# EAGLE design eduino_wifi_rev3 (EAGLE 7.6.0)
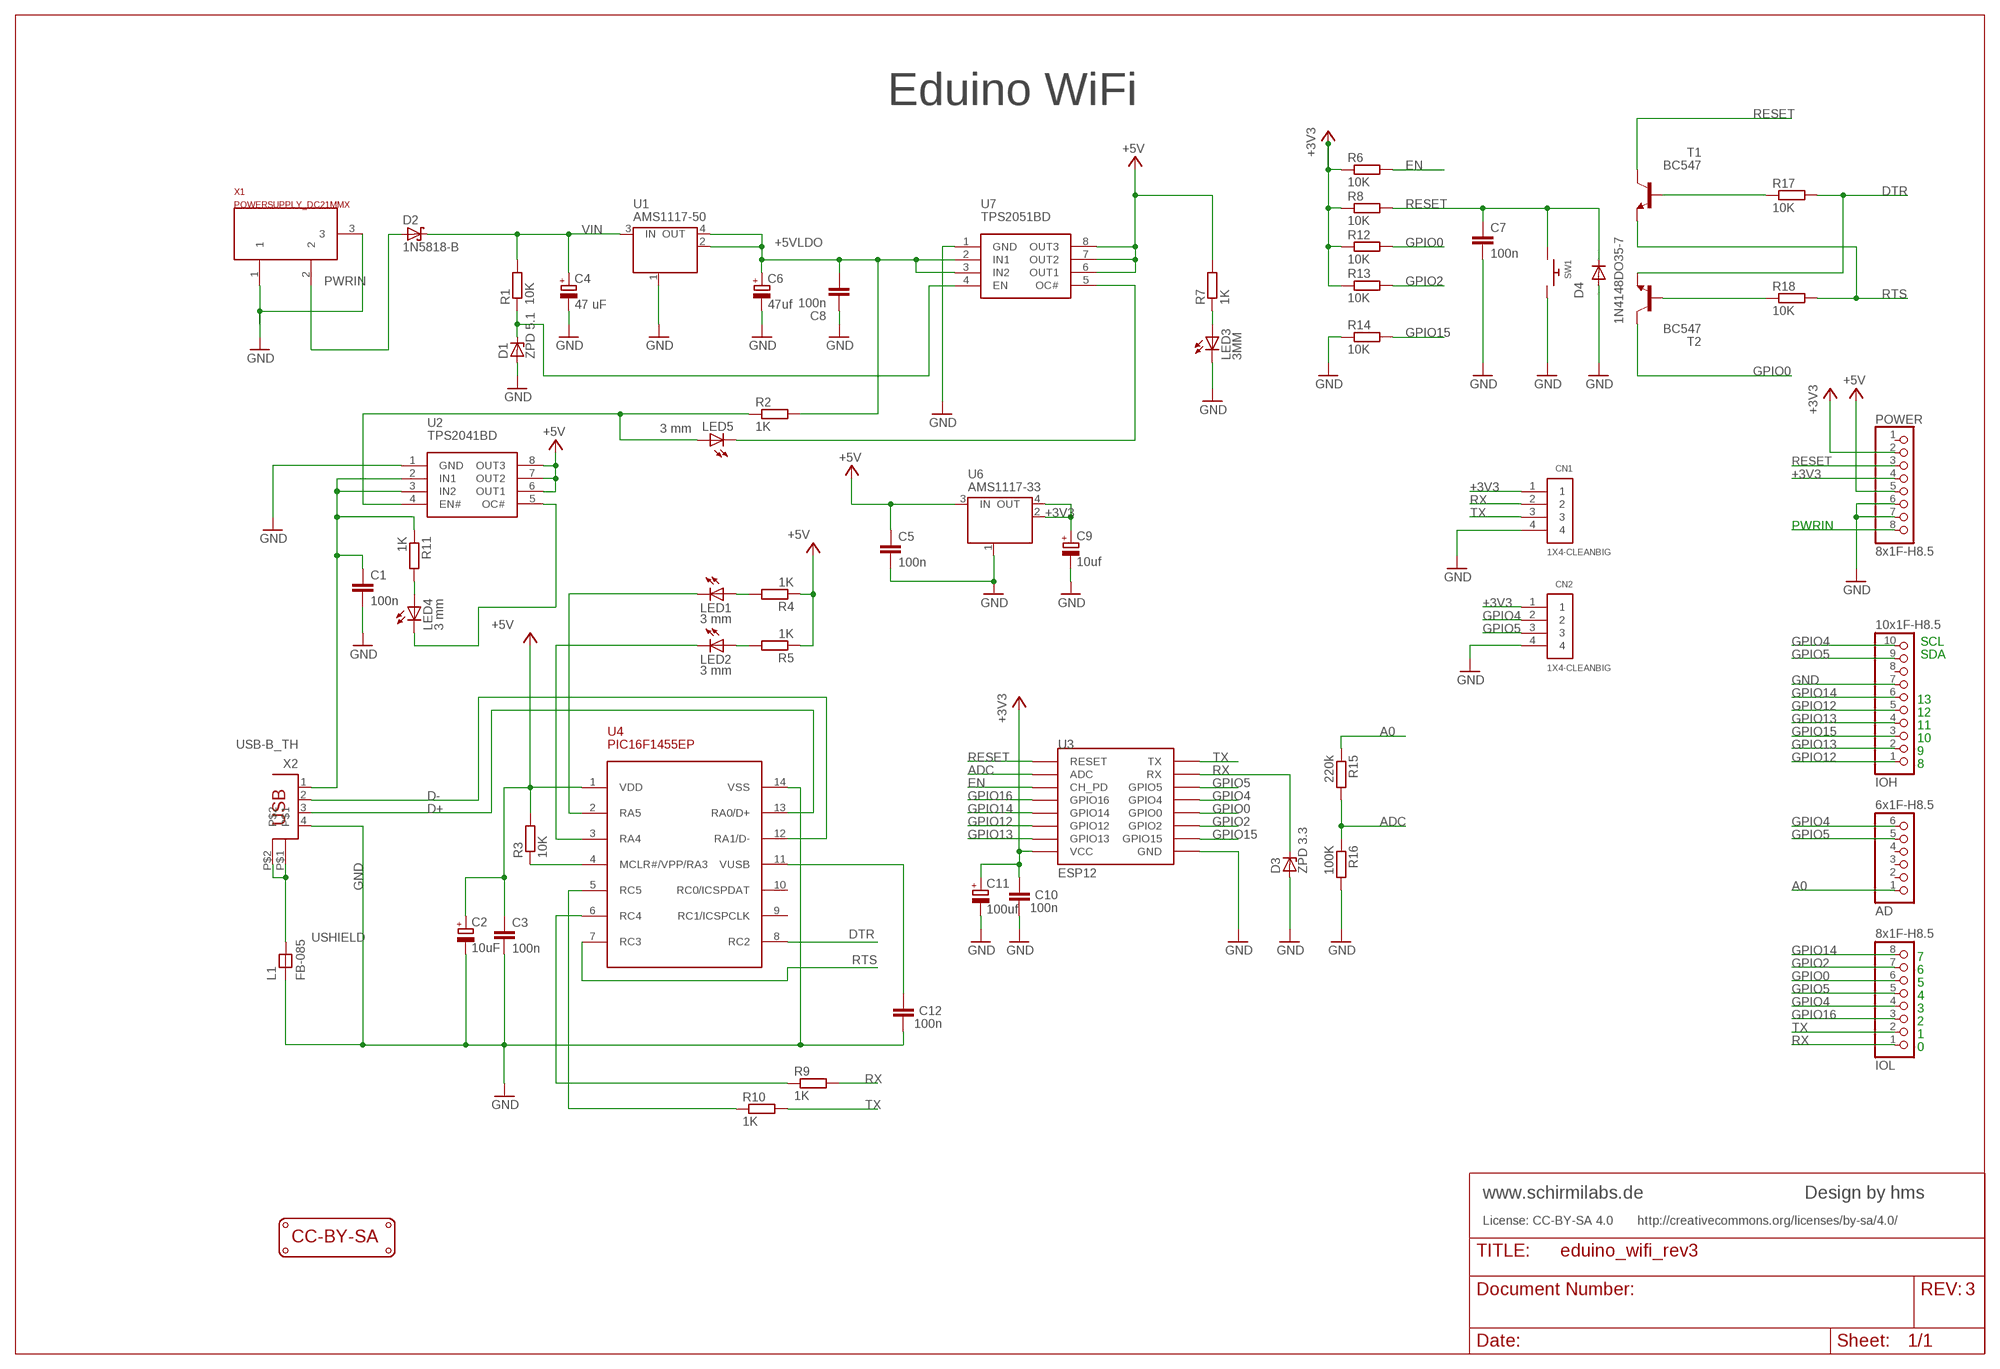
[diagram p0: schematic, sheet 1]

## Parts
AD  6x1F-H8.5  PINHD-1X6  [1X06]
C1  100n  C-EU025-024X044  [C025-024X044]
C2  10uF  CPOL-EUE2-5  [E2-5]
C3  100n  C-EU025-024X044  [C025-024X044]
C4  47 uF  CPOL-EUE2-5  [E2-5]
C5  100n  C-EU025-024X044  [C025-024X044]
C6  47uf  CPOL-EUE2-5  [E2-5]
C7  100n  C-EU025-024X044  [C025-024X044]
C8  100n  CAPACITOR_NPOL-PTH_0.1"  [C0.1PTH]
C9  10uf  CPOL-EUE2-5  [E2-5]
C10  100n  CAPACITOR_NPOL-PTH_0.1"  [C0.1PTH]
C11  100uf  CPOL-EUE2-5  [E2-5]
C12  100n  CAPACITOR_NPOL-PTH_0.1"  [C0.1PTH]
CN1  1X4-CLEANBIG  [1X04-CLEANBIG]
CN2  1X4-CLEANBIG  [1X04-CLEANBIG]
D1  ZPD 5.1  ZENER-DIODEDO35Z10  [DO35Z10]
D2  1N5818-B  [DO41-7.6]
D3  ZPD 3.3  ZPD  [DO35Z10]
D4  1N4148DO35-7  [DO35-7]
IOH  10x1F-H8.5  PINHD-1X10_ARD  [1X10]
IOL  8x1F-H8.5  PINHD-1X8  [1X08]
L1  FB-085  [FB-085]
LED1  3 mm  LED-3MM  [LED-3MM]
LED2  3 mm  LED-3MM  [LED-3MM]
LED3  3MM  LED-3MM  [LED-3MM]
LED4  3 mm  LED-3MM  [LED-3MM]
LED5  3 mm  LED-3MM  [LED-3MM]
LOGO1  LOGO_CC-BY-SA  [LOGO_CC-BY-SA]
POWER  8x1F-H8.5  PINHD-1X8  [1X08]
R1  10K  RESISTOR-PTH-0.4  [RTH025W]
R2  1K  RESISTOR-PTH-0.4  [RTH025W]
R3  10K  R-EU_0207/10  [0207/10]
R4  1K  RESISTOR-PTH-0.4  [RTH025W]
R5  1K  RESISTOR-PTH-0.4  [RTH025W]
R6  10K  RESISTOR-PTH-0.4  [RTH025W]
R7  1K  RESISTOR-PTH-0.4  [RTH025W]
R8  10K  RESISTOR-PTH-0.4  [RTH025W]
R9  1K  R-EU_0207/10  [0207/10]
R10  1K  R-EU_0207/10  [0207/10]
R11  1K  RESISTOR-PTH-0.4  [RTH025W]
R12  10K  RESISTOR-PTH-0.4  [RTH025W]
R13  10K  RESISTOR-PTH-0.4  [RTH025W]
R14  10K  RESISTOR-PTH-0.4  [RTH025W]
R15  220k  RESISTOR-PTH-0.4  [RTH025W]
R16  100K  RESISTOR-PTH-0.4  [RTH025W]
R17  10K  RESISTOR-PTH-0.4  [RTH025W]
R18  10K  RESISTOR-PTH-0.4  [RTH025W]
SW1  SWITCH_PUSHBUTTONEVQ-PE  [TACT_PANA-EVQ]
T1  BC547  [TO92]
T2  BC547  [TO92]
U1  AMS1117-50  MC33269ST-3.3T3  [SOT223]
U2  TPS2041BD  [SOIC-8]
U3  ESP12  ESP12SMD  [ESP12-SMD]
U4  PIC16F1455EP  [DIL14]
U6  AMS1117-33  MC33269ST-3.3T3  [SOT223]
U7  TPS2051BD  [SOIC-8]
X1  POWERSUPPLY_DC21MMX  [POWERSUPPLY_DC-21MM]
X2  USB-B_TH  PN61729  [PN61729]

## Nets
+3V3: C9.+ C10.2 C11.+ CN1.1 CN2.1 POWER.2 POWER.4 R6.1 R8.1 R12.1 R13.1 U3.VCC U6.2(OUT) U6.4(OUT)
+5V [usbvcc]: C2.+ C3.1 C5.1 POWER.5 R3.2 R4.1 R5.1 R7.2 U2.6(OUT1) U2.7(OUT2) U2.8(OUT3) U4.1(VDD) U6.3(IN) U7.6(OUT1) U7.7(OUT2) U7.8(OUT3)
+5VLDO [usbvcc]: C6.+ C8.2 R2.2 U1.2(OUT) U1.4(OUT) U7.2(IN1) U7.3(IN2)
A0: AD.1 R15.1
ADC: R15.2 R16.1 U3.ADC
D+: U4.13(RA0/D+) X2.3
D-: U4.12(RA1/D-) X2.2
DTR: R17.2 T2.1(E) U4.8(RC2)
EN: R6.2 U3.CH_PD
GND [gnd]: C1.2 C2.- C3.2 C4.- C5.2 C6.- C7.2 C8.1 C9.- C10.1 C11.- C12.1 CN1.4 CN2.4 D1.A D3.A D4.A IOH.7 L1.1 LED3.K(C) POWER.6 POWER.7 R14.1 R16.2 SW1.P$2 U1.1(GND/ADJ) U2.1(GND) U3.GND U4.14(VSS) U6.1(GND/ADJ) U7.1(GND) X1.1 X1.3 X2.4
GPIO0: IOL.6 R12.2 T2.3(C) U3.GPIO0
GPIO2: IOL.7 R13.2 U3.GPIO2
GPIO4: AD.6 CN2.2 IOH.10 IOL.4 U3.GPIO4(GPIO5)
GPIO5: AD.5 CN2.3 IOH.9 IOL.5 U3.GPIO5(GPIO4)
GPIO12: IOH.1 IOH.5 U3.GPIO12
GPIO13: IOH.2 IOH.4 U3.GPIO13
GPIO14: IOH.6 IOL.8 U3.GPIO14
GPIO15: IOH.3 R14.2 U3.GPIO15
GPIO16: IOL.3 U3.GPIO16
M8RXD: R9.1 U4.6(RC4)
M8TXD: R10.1 U4.5(RC5)
N$1: LED3.A R7.1
N$2: LED4.K(C) U2.5(OC#)
N$4: R3.1 U4.4(MCLR#/VPP/RA3)
N$5: LED1.K(C) U4.2(RA5)
N$6: LED2.K(C) U4.3(RA4)
N$7: LED1.A R4.2
N$8: LED2.A R5.2
N$9: C1.1 R11.1 U2.2(IN1) U2.3(IN2) X2.1
N$10: D1.C R1.1 U7.4(EN)
N$11 [usbvcc]: LED5.A R2.1 U2.4(EN#)
N$12: R17.1 T1.2(B)
N$13: LED4.A R11.2
N$15: C12.2 U4.11(VUSB)
N$17: LED5.K(C) U7.5(OC#)
N$21: R18.1 T2.2(B)
PWRIN [power]: D2.A POWER.8 X1.2
RESET: C7.1 D4.C POWER.3 R8.2 SW1.P$1 T1.3(C) U3.RESET
RTS: R18.2 T1.1(E) U4.7(RC3)
RX: CN1.2 D3.C IOL.1 R9.2 U3.RXD0(RX)
TX: CN1.3 IOL.2 R10.2 U3.TXD0(TX)
USHIELD [gnd]: L1.2 X2.P$1 X2.P$2
VIN [power]: C4.+ D2.C R1.2 U1.3(IN)
Unconnected: AD.2 AD.3 AD.4 IOH.8 POWER.1 U4.9(RC1/ICSPCLK) U4.10(RC0/ICSPDAT)

## Notes on the sheet
- Eduino WiFi
- PWRIN
- SCL
- SDA
- 13
- 12
- 11
- 10
- 9
- 8
- 7
- 6
- 5
- 4
- 3
- 2
- 1
- 0
- www.schirmilabs.de | Design by hms
- License: CC-BY-SA 4.0 | http://creativecommons.org/licenses/by-sa/4.0/
- 3

## Library data of the parts
AD = SmartPrj:PINHD-1X6: PIN HEADER
C1 C3 C5 C7 = resistor:C-EU: CAPACITOR, European symbol
C2 C4 C6 C9 C11 = resistor:CPOL-EU: POLARIZED CAPACITOR, European symbol
C8 C10 C12 = dp_devices:CAPACITOR_NPOL: Non-Polarized capacitor in various packages
CN1 CN2 = adafruit:1X4: 4-pin connector
D1 = diode:ZENER-DIODE: Z-Diode
D2 = diode:1N581*: 1.0A SCHOTTKY BARRIER RECTIFIER Source: http://www.diodes.com/datasheets/ds23001.pdf
D3 = diode:ZPD: Z DIODE 500 mW
D4 = diode:1N4148: DIODE high speed (Philips)
IOH = SmartPrj:PINHD-1X10_ARD: PIN HEADER
IOL POWER = SmartPrj:PINHD-1X8: PIN HEADER
L1 = inductors-jwmiller:FB: FERRITE BEAD
LED1-LED5 = dp_devices:LED: Light Emitting Diode
LOGO1 = dp_devices(1):LOGO_CC-BY-SA
R1 R2 R4-R8 R11-R18 = dp_devices:RESISTOR
R3 R9 R10 = resistor:R-EU_: RESISTOR, European symbol
SW1 = adafruit:SWITCH_PUSHBUTTON: Buttons SOFTTOUCHSMD_SJ - Soft touch temporary push button (Super Junk Akihabara) Compatible with SKPMANE010 [Mouser: 688-SKPMAN] C&K_KSS = Digikey: KSS221GLFS
T1 T2 = transistor-neu-to92:BC547: NPN TRANSISTOR
U1 U6 = linear:MC33269ST*: Adjustable Output Low Dropout Voltage Regulator 800 mA Source: http://www.onsemi.com/pub/Collateral/MC33269-D.PDF
U2 = schirmilabs:TPS2041BD
U3 = esp8266modules:ESP12: ESP8266 Wifi module 12
U4 = pic16f1455:PIC16F1455EP
U7 = schirmilabs:TPS2051BD
X1 = SmartPrj:POWERSUPPLY_DC21MM
X2 = SmartPrj:PN61729: BERG USB connector

## Net classes
0 default: width 0.254 mm, clearance 0.254 mm
1 power: width 0.61 mm, drill 0.61 mm, clearance 0.205 mm to class 0, clearance 0.254 mm
2 gnd: width 0.305 mm, drill 0.559 mm, clearance 0.205 mm to class 0, clearance 0.205 mm to class 1, clearance 0.254 mm
3 usbvcc: width 0.508 mm, drill 0.61 mm, clearance 0.205 mm to class 0, clearance 0.205 mm to class 1, clearance 0.205 mm to class 2, clearance 0.254 mm
4 aref: width 0.406 mm, drill 0.61 mm, clearance 0.205 mm to class 0, clearance 0.205 mm to class 1, clearance 0.205 mm to class 2, clearance 0.205 mm to class 3, clearance 0.254 mm

## Board
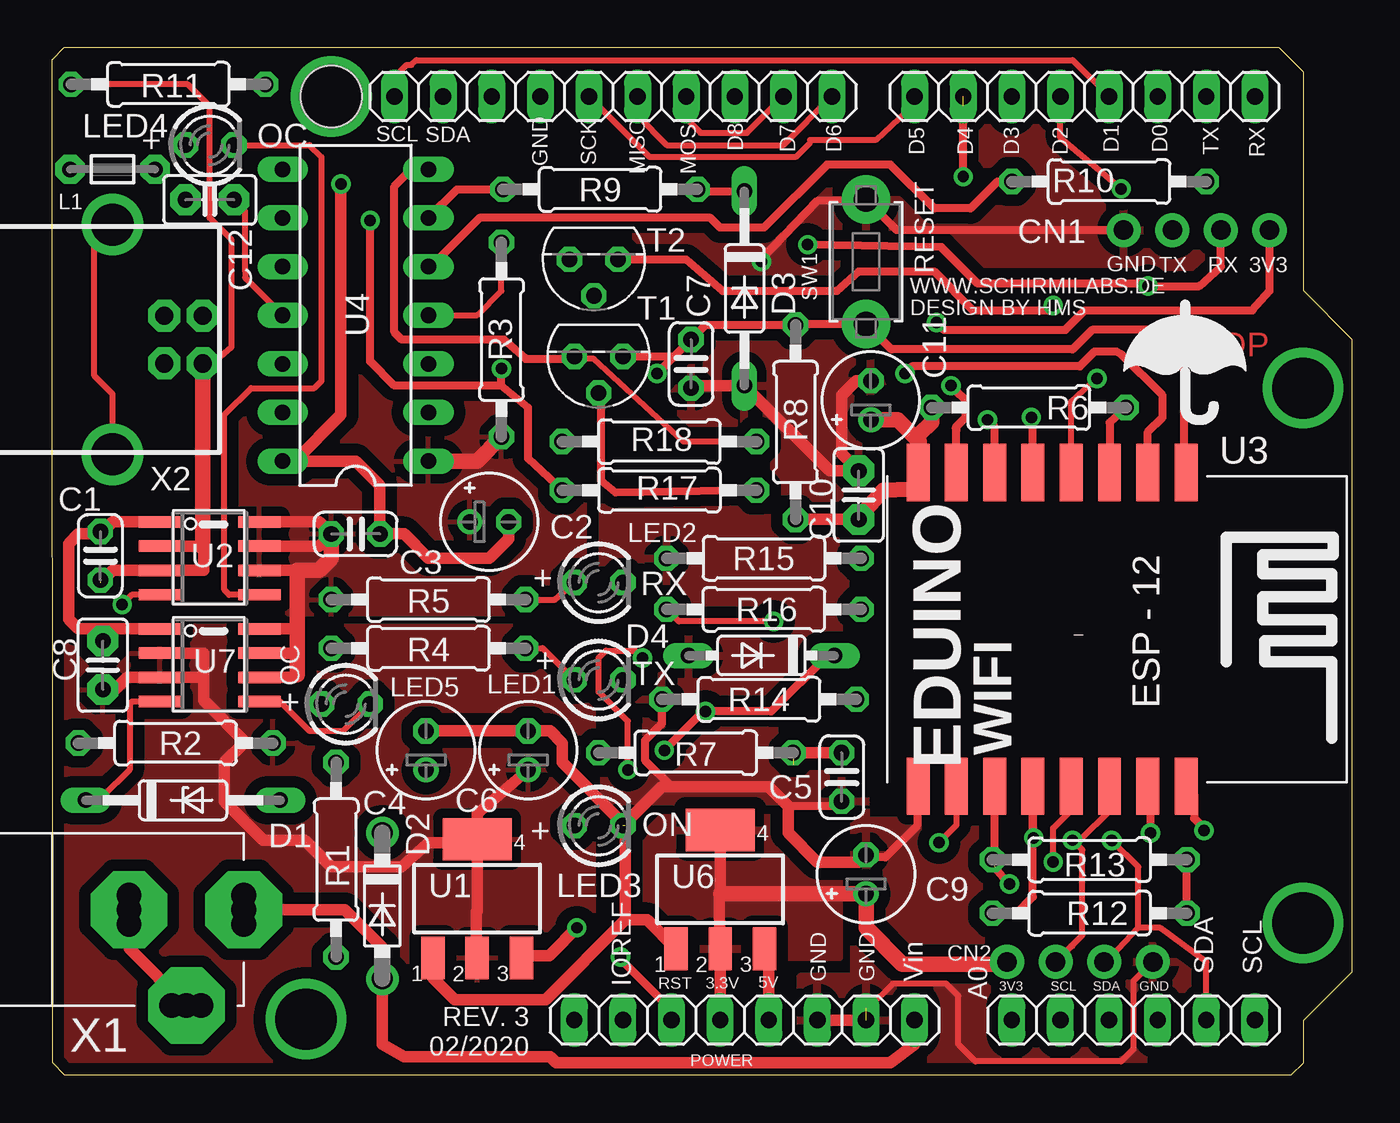
[diagram p1: board, top side]
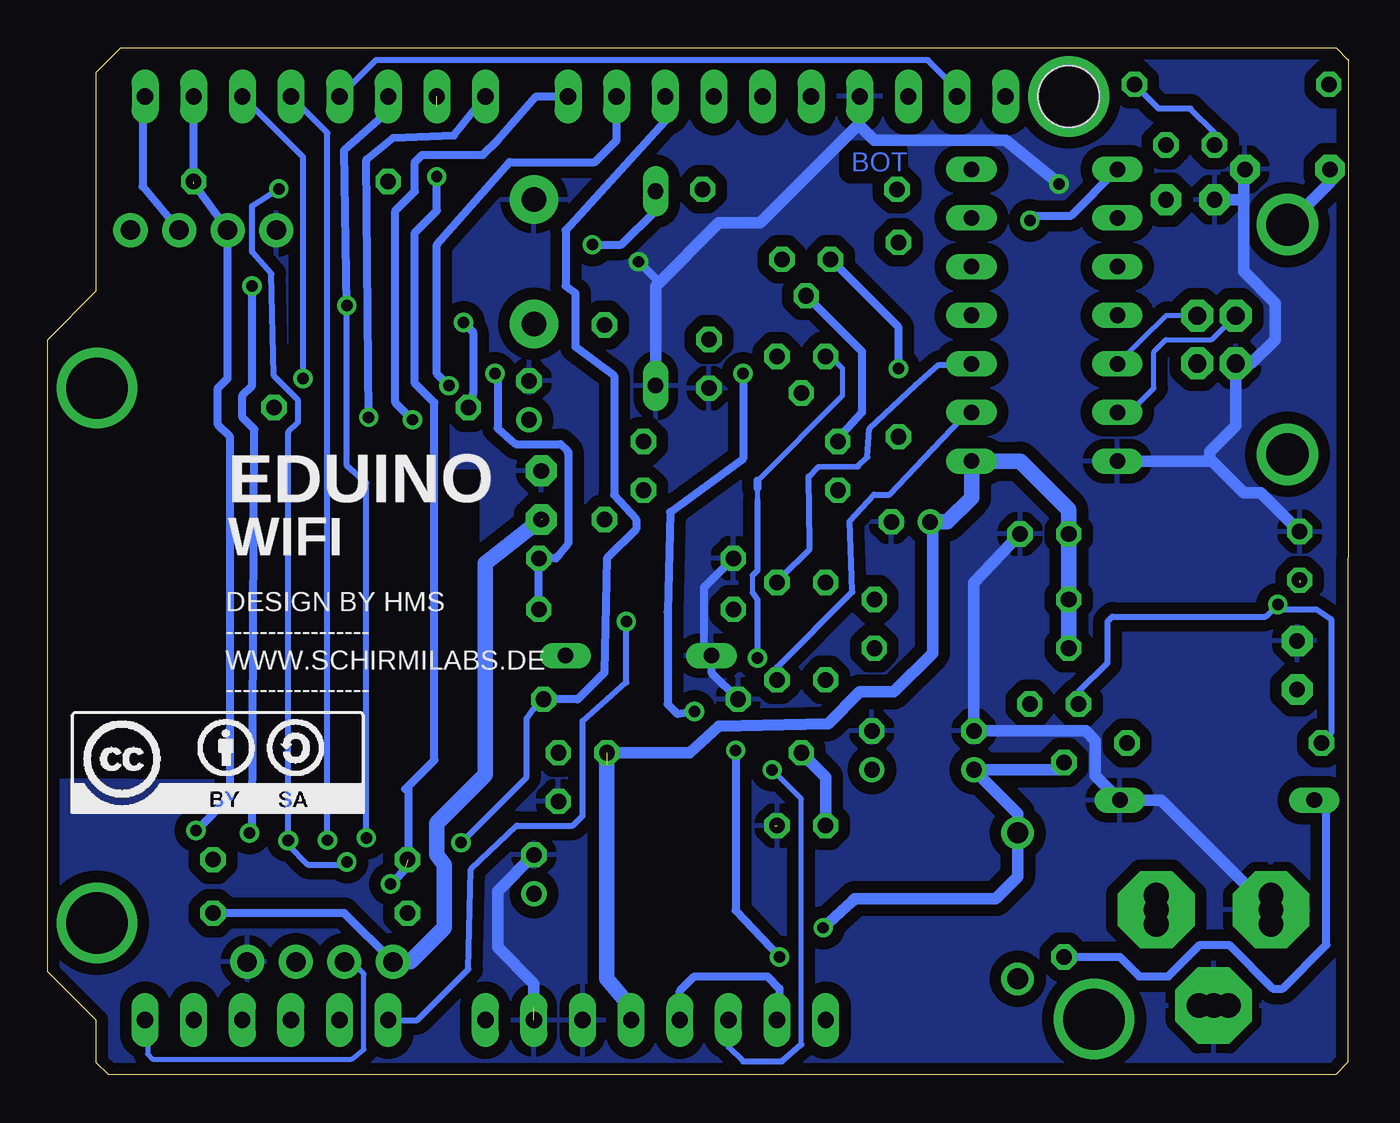
[diagram p2: board, bottom side, seen from below]

Size 67.94 x 53.66 mm. Coordinates in mm from the lower left corner, seen from the top.
Outline: 0,53.07 0.03,0.99 0.02,0.65 0.65,0 64.77,0 65.41,0.63 65.41,2.86 67.94,5.4 67.94,38.42 65.41,40.96 65.41,52.39 64.14,53.66 0.64,53.66 0,53.02
Copper layers (1*16): Top 0.035mm / dielectric 1.5mm / Bottom 0.035mm
Design rules "eduino_One_Rev0 *": minimum track width 10mil, minimum drill 24mil, track to track 0.205mm, track to pad 0.205mm, pad to pad 0.205mm, via to via 0.205mm, smd to smd 8mil, copper to edge 12mil, drill to drill 8mil, minimum pad ring 10mil, minimum via ring 8mil, stop-mask expansion 4mil, vias tented up to drill 24mil, thermal gap 0.5mm
Holes 3.2 mm at 14.61,51.12

### Footprints (pad centres in the part's own frame; a part is rotated, then mirrored left to right if it is on the bottom)
1X06 = drill 0.85 pad 1.422 long: 1 -6.35,0; 2 -3.81,0; 3 -1.27,0; 4 1.27,0; 5 3.81,0; 6 6.35,0
C025-024X044 = drill 0.813 octagon: 1 -1.27,0; 2 1.27,0
E2-5 = drill 0.813 pad 1.27: + -1.016,0 | drill 0.813 pad 1.27 octagon: - 1.016,0
C0.1PTH = drill 0.813 pad 1.6 octagon: 1 -1.27,0; 2 1.27,0
1X04-CLEANBIG = drill 1.016 pad 1.778: 1 -3.81,0; 2 -1.27,0; 3 1.27,0; 4 3.81,0
DO35Z10 = drill 0.813 long: A 5.08,0; C -5.08,0
DO41-7.6 = drill 1.1 pad 1.7: A 3.81,0; C -3.81,0
DO35-7 = drill 0.813 long: A 3.81,0; C -3.81,0
1X10 = drill 0.85 pad 1.422 long: 1 -11.43,0; 2 -8.89,0; 3 -6.35,0; 4 -3.81,0; 5 -1.27,0; 6 1.27,0; 7 3.81,0; 8 6.35,0; 9 8.89,0; 10 11.43,0
1X08 = drill 0.85 pad 1.422 long: 1 -8.89,0; 2 -6.35,0; 3 -3.81,0; 4 -1.27,0; 5 1.27,0; 6 3.81,0; 7 6.35,0; 8 8.89,0
FB-085 = drill 0.813 pad 1.524 octagon: 1 -2.223,0; 2 2.223,0
LED-3MM = drill 0.813 octagon: A -1.27,0; K 1.27,0
RTH025W = drill 0.813 octagon: 1 -5.08,0; 2 5.08,0
0207/10 = drill 0.813 octagon: 1 -5.08,0; 2 5.08,0
TACT_PANA-EVQ = drill 1.3 pad 2.54: P$1 -3.25,0; P$2 3.25,0
TO92 = drill 0.813 octagon: 1 1.27,0; 2 0,1.905; 3 -1.27,0
SOT223 = smd 1.219 x 2.235: 1 -2.311,-3.099; 2 0,-3.099; 3 2.311,-3.099 | smd 3.6 x 2.2: 4 0,3.099
SOIC-8 = smd 0.6 x 2.2: 1 -1.905,-2.6; 2 -0.635,-2.6; 3 0.635,-2.6; 4 1.905,-2.6; 5 1.905,2.6; 6 0.635,2.6; 7 -0.635,2.6; 8 -1.905,2.6
ESP12-SMD = smd 3 x 1.2: ADC -8.3,3.8; CH_PD -8.3,1.8; GND 8.1,-8.2; GPIO0 8.1,-2.2; GPIO2 8.1,-4.2; GPIO4 8.1,1.8; GPIO5 8.1,-0.2; GPIO12 -8.3,-4.2; GPIO13 -8.3,-6.2; GPIO14 -8.3,-2.2; GPIO15 8.1,-6.2; GPIO16 -8.3,-0.2; RESET -8.3,5.8; RXD0 8.1,3.8; TXD0 8.1,5.8; VCC -8.3,-8.2
DIL14 = drill 0.813 long: 1 -7.62,-3.81; 2 -5.08,-3.81; 3 -2.54,-3.81; 4 0,-3.81; 5 2.54,-3.81; 6 5.08,-3.81; 7 7.62,-3.81; 8 7.62,3.81; 9 5.08,3.81; 10 2.54,3.81; 11 0,3.81; 12 -2.54,3.81; 13 -5.08,3.81; 14 -7.62,3.81
POWERSUPPLY_DC-21MM = drill 1.3 pad 4 octagon: 1 -5.08,-3.353; 2 -0.076,-6.35; 3 -0.076,-0.356 | drill 1.3: 4 -5.08,-4.115; 5 -5.08,-2.591; 6 -0.838,-0.356; 7 0.686,-0.356; 8 -0.838,-6.35; 9 0.686,-6.35
PN61729 = drill 0.95 pad 1.676 octagon: 1 1.25,4.71; 2 -1.25,4.71; 3 -1.25,2.71; 4 1.25,2.71 | drill 2.2: P$1 -6,0; P$2 6,0

### Placement (x,y rotation side)
AD  56.52,2.86 0 top
C1  2.54,27.11 90 top
C2  22.86,28.89 0 top
C3  15.88,28.26 0 top
C4  19.56,16.95 90 top
C5  41.27,15.56 270 top
C6  24.89,16.95 90 top
C7  33.4,37.15 270 top
C8  2.67,21.4 270 top
C9  42.55,10.48 90 top
C10  42.16,30.29 270 top
C11  42.8,35.24 90 top
C12  8.25,45.72 0 top
CN1  59.82,44.13 180 top
CN2  53.72,5.91 0 top
D1  6.86,14.35 0 top
D2  17.27,8.83 270 top
D3  36.2,41.08 270 top
D4  37.08,21.91 180 top
IOH  29.34,51.12 180 top
IOL  53.97,51.12 180 top
L1  3.18,47.31 180 top
LED1  28.58,20.64 0 top
LED2  28.58,25.72 0 top
LED3  28.58,13.02 0 top
LED4  8.25,48.58 0 top
LED5  15.37,19.37 0 top
LOGO1  66.73,13.65 0 bottom
POWER  36.2,2.86 0 top
R1  14.86,11.24 90 top
R2  6.48,17.34 0 top
R3  23.49,38.42 270 top
R4  19.69,22.29 0 top
R5  19.69,24.83 0 top
R6  51.05,34.86 0 top
R7  33.66,16.83 0 top
R8  38.86,34.1 90 top
R9  28.65,46.27 0 top
R10  55.25,46.67 0 top
R11  6.1,51.75 0 top
R12  54.23,8.45 180 top
R13  54.23,11.24 180 top
R14  36.96,19.62 0 top
R15  37.21,24.32 0 top
R16  37.21,26.99 180 top
R17  31.75,30.54 180 top
R18  31.75,33.08 0 top
SW1  42.55,42.48 90 top
T1  28.58,37.53 180 top
T2  28.32,42.61 180 top
U1  22.23,9.21 0 top
U2  8.25,26.99 270 top
U3  53.47,23.18 270 top
U4  15.88,39.69 90 top
U6  34.92,9.69 0 top
U7  8.25,21.4 270 top
X1  3.68,8.7 90 top
X2  3.18,38.42 270 top

### Tracks (layer width: path | path; a pad name or v marks a point on that pad's centre or on a via)
+3V3  (via drill 0.6)  (1 unrouted)
  Top 0.406: 34.9,6.79 34.92,6.79 | U3.VCC 44.83,30.59 | 44.83,30.59 44.96,30.54 45.34,30.92 | 45.34,33.08 45.34,33.46 | R12.1 R13.1 | v46.23,39.31 46.61,38.93 52.96,38.93 53.97,39.94 62.74,39.94 63.63,40.96 CN1.1 | 44.83,30.59 44.96,30.71
  Top 0.61: 34.9,6.79 34.87,9.41 34.95,9.46 34.92,9.49 34.92,12 | 34.92,6.79 POWER.4 | CN2.1 49.78,5.78 | R8.1 C10.2
  Top 0.813: 34.95,9.46 C9.+ 42.55,7.68 44.45,5.78 49.78,5.78 | 45.34,30.92 45.34,33.08 44.2,34.23 C11.+ | 45.34,33.46 45.97,34.1 R6.1 | 44.83,30.59 43.43,30.54 42.12,29.06
  Bottom 0.406: CN2.1 52.45,8.45 R12.1 | POWER.4 34.92,4.38 34.16,5.14 30.35,5.14 29.72,4.51 29.72,2.98 POWER.2 | v46.23,39.31 45.72,38.8 45.72,35.62 R6.1
  Bottom 0.61: 49.02,5.91 CN2.1
  Bottom 0.813: 49.02,5.91 47.24,7.68 47.24,10.99 47.62,11.49 47.62,13.14 45.09,15.68 45.09,26.73 C10.2
  pour Top (isolate 0.61): 30.61,13.78 30.61,5.52 38.35,5.52 38.35,6.16 41.15,6.16 41.15,13.4 31.5,13.4 31.5,13.78
+5V  (1 unrouted)
  Top 0.406: U6.3 37.21,6.59 37.21,6.16 37.47,6.16 POWER.5
  Top 0.61: 37.47,5.4 POWER.5 | U2.7 13.97,27.62 C3.1 13.97,28.89 U2.8 | U2.6 12.83,26.35 | U7.6 12.7,20.76 12.83,20.89 | U7.7 12.83,22.03 | U7.8 12.83,23.3 | C5.1 R7.2
  Top 0.813: C3.1 14.61,26.99 13.97,26.35 12.83,26.35 12.83,23.3 12.83,22.03 12.83,20.89 | R3.2 22.23,32.07 U4.1
  Bottom 0.61: 37.47,3.49 POWER.5 | R7.2 34.42,16.83 32.89,18.22 27.18,18.35 25.53,20 23.75,20 21.72,22.03 21.72,28.77 C2.+
  Bottom 0.813: R4.1 R5.1 C3.1 14.61,29.53 17.15,32.07 U4.1 | 38.73,16.19 38.73,5.02 37.47,3.49 | C2.+ 20.95,28.89 19.69,30.16 19.69,31.43
  pour Top (isolate 0.61): 28.07,24.07 1.65,24.07 0.64,25.08 0.64,52.64 1.27,53.28 27.56,53.28 27.81,53.02 27.81,24.32
+5VLDO
  Top 0.406: U1.2 22.17,6.16
  Top 0.61: U7.2 7.95,22.03 7.95,20.76 | 7.95,20.76 U7.3 3.94,20.76 3.3,20.13 C8.2 | 7.95,20.76 7.95,19.57 10.16,17.34 | R2.2 10.16,17.34 | 10.16,17.34 10.03,17.34 9.02,16.32 9.02,14.29 11.05,12.26 13.21,12.26 14.61,10.86 18.29,10.86 19.69,12.13 22.05,12.13 U1.4 | U1.4 22.23,13.65 C6.+ | 22.17,6.16 22.17,8.52 22.23,8.57 U1.4
  pour Top (isolate 0.61): 0.38,0.95 1.02,0.32 28.19,0.32 28.32,0.44 28.32,23.3 28.19,23.43 0.89,23.43 0.38,23.94
A0  (via drill 0.6)
  Top 0.305: v37.72,23.69 32.77,23.69 R15.1
  Bottom 0.305: AD.1 48.64,2.86 45.97,5.52 45.85,10.73 43.43,13.02 40.51,13.02 40.01,13.53 40.01,18.48 37.72,20.51 v37.72,23.69
ADC  (via drill 0.6)
  Top 0.406: U3.ADC 57.28,33.59 58.04,34.35 58.04,35.5 55.88,37.66 55.63,37.78 54.48,37.78 53.72,37.02 44.96,37.02 v44.58,36.64
  Bottom 0.406: R15.2 R16.1 41.4,26.99 41.27,27.11 40.77,27.75 40.77,32.46 | v44.58,36.64 44.45,36.64 44.45,33.78 43.5,32.96 41.17,32.96 41.05,32.85 40.88,32.71 40.82,32.61 40.77,32.46 | 40.77,32.58 40.77,32.46
D+
  Bottom 0.254: U4.13 11.43,34.61 10.16,35.88 10.16,37.78 9.52,38.42 7.14,38.42 X2.3
D-
  Bottom 0.254: X2.2 9.5,39.67 10.8,38.42 U4.12
DTR  (via drill 0.6)
  Top 0.406: R17.2 24.89,32.19 24.89,34.86 23.49,36 | 23.49,36 17.91,36 16.64,37.27 v16.64,44.64 | 23.49,36 v23.49,36.89
  Bottom 0.406: v16.64,44.64 16.38,44.89 14.48,44.89 U4.8 | v23.49,36.89 23.49,39.05 T2.1
EN
  Top 0.406: R6.2 55.27,34.08 U3.CH_PD
GND  (via drill 0.6)  (2 unrouted)
  Top 0.305: C1.2 2.54,28.26 | CN2.4 56.52,4.89 56.52,1.33 55.88,0.7 48.26,0.7 47.37,1.59 47.37,4.13 46.74,4.76 43.94,4.76 42.67,3.49 42.55,3.49
  Top 0.406: CN1.4 44.14,44.13 SW1.P$2 42.11,45.66 40.01,45.66 37.08,42.61 v37.08,42.48 | C5.2 41.02,14.03 38.48,14.03 | 45.21,14.29 45.21,14.16 | 45.21,14.16 45.27,14.16 U3.GND | R14.1 31.88,18.35 30.99,17.46 30.99,16.45 32.38,15.05 | 45.21,14.16 45.21,13.02 43.56,11.37 42.67,11.37 C9.-
  Top 0.61: 2.54,28.26 3.18,28.89 U2.1 | POWER.7 POWER.6 | C2.- 23.88,28 22.86,26.99 19.69,26.99 18.41,28.26 C3.2 17.15,30.8 15.88,32.07 12.7,32.07 | 12.7,32.07 U4.14 | C9.- 42.16,11.11 40.01,11.11 38.48,12.64 38.48,14.03 37.47,15.05 32.38,15.05 31.88,15.05 LED3.K 29.84,13.14 26.67,16.32 26.67,17.34 26.03,17.97 C6.- C4.- | U7.1 2.92,23.3 | 2.92,23.3 1.4,23.3 0.89,23.81 0.89,27.75 1.4,28.26 2.41,28.26 C1.2 | U1.1 19.9,5.08 21.05,3.92 25.81,3.92 29.97,8.09 | 29.97,8.09 29.97,13.02 | C8.1 2.67,23.05 2.92,23.3 | v15.11,46.55 15.11,34.48 12.7,32.07 | X1.3 4.04,6.62 X1.1 | U6.1 31.12,8.09 29.97,8.09 | C7.2 33.53,36 D3.A 40.64,31.56 C10.1 41.27,32.45 41.27,35.5 42.04,36.26 C11.-
  Bottom 0.406: v37.08,42.48 36.2,41.59 36.2,41.21 | R14.1 33.27,21.02 D4.A 33.27,22.03 33.66,22.42 33.66,25.46 R16.2
  Bottom 0.61: 7.24,32.07 7.24,32.55 5.89,33.91 X2.4 5.06,37.17 3.81,38.42 3.81,40.32 5.46,41.97 5.46,45.72 | 5.46,45.72 5.46,46.99 L1.1 | POWER.7 42.55,4.76 44.45,6.67 44.45,9.59 C9.- | C12.1 5.46,45.72 | U4.14 7.24,32.07 | 7.24,32.07 7.11,32.07 5.46,30.42 4.57,30.42 C1.2 | v15.11,46.55 17.91,48.83 24.77,48.83 25.53,49.59 IOH.7 25.53,49.72 30.73,44.51 32.89,44.51 36.2,41.21 D3.A | C3.2 19.56,25.72 C4.- 13.72,17.97 13.21,17.46 13.21,15.62 D1.A 9.77,14.35 X1.3
  pour Bottom (isolate 0.61): -0.32,53.34 -0.32,0.32 65.09,0.32 65.09,2.86 67.63,5.4 67.94,15.43 45.34,15.3 45.34,30.92 45.21,30.92 45.21,31.69 67.82,31.69 67.75,38.29 65.09,40.96 65.09,52.39 64.14,53.34
  pour Top (isolate 0.61): 41.91,5.12 39.12,5.12 39.12,0.57 65.09,0.63 65.09,3.18 67.63,5.71 67.82,12.26 67.82,13.4 42.55,13.27 42.29,33.08 67.94,33.08 67.63,38.42 65.41,40.64 65.41,52.07 64.14,53.34 49.53,53.34 28.64,53.45 28.83,14.29 41.91,14.29
GPIO0  (via drill 0.6)
  Top 0.305: U3.GPIO0 51.31,15.04 v51.31,12.38
  Top 0.406: R12.2 50.42,8.45 51.27,9.29 U3.GPIO0 | T2.3 33.15,42.61 35.05,40.96 41.02,40.96 42.16,41.97 46.1,41.97 48.13,39.94 52.2,39.94 v52.32,40.2
  Bottom 0.305: v51.31,12.38 51.31,30.92 52.32,31.81 v52.32,40.2
  Bottom 0.406: v52.32,40.2 52.45,48.32 50.04,50.48 50.04,50.99 IOL.6
GPIO2  (via drill 0.6)  (2 unrouted)
  Top 0.406: v50.04,9.97 49.27,10.85 U3.GPIO2 | v47.62,46.93 47.62,50.61
  Bottom 0.406: 49.28,14.92 49.08,15.11 | 49.08,15.11 47.75,16.45 47.75,35.12 48.77,36.13 48.77,44.01 47.62,45.15 v47.62,46.93 | 49.08,15.11 49.08,10.92 v50.04,9.97
GPIO4  (via drill 0.6)
  Top 0.305: CN2.2 53.27,6.72 53.34,6.72 53.34,6.79 53.85,7.3 53.85,11.75 v53.34,12.26 53.27,12.33 53.79,12.33 55.25,13.78 55.25,16.26 U3.GPIO4 | 17.91,52.01 17.91,52.13 18.54,52.77 18.8,52.77 19.05,53.02 53.34,53.02 IOL.4
  Top 0.406: IOH.10 17.91,52.01
  Bottom 0.254: AD.6 62.74,2.73 62.74,1.08 62.48,0.83 52.07,0.83 51.44,1.33 51.44,5.27 52.07,5.91 CN2.2
  Bottom 0.305: v53.34,12.26 53.34,49.21 IOL.4
GPIO5  (via drill 0.6)
  Top 0.254: 54.99,5.78 CN2.3 55.27,6.18
  Top 0.305: AD.5 60.33,5.91 57.91,7.68 56.77,7.68 | 56.77,7.68 54.99,5.78 | v55.88,46.29 52.7,48.96 IOL.5 | 56.77,7.68 56.77,10.86 v55.39,12.23 v55.37,12.26 | v52.32,11.11 52.32,12.89 53.21,13.78 53.21,16.22 U3.GPIO5
  Bottom 0.305: IOH.9 20.45,51.5 21.97,53.02 50.8,53.02 IOL.5 | v55.37,12.26 55.37,33.59 54.86,34.1 54.86,35.24 56.13,36.51 56.26,41.85 57.28,42.99 57.28,45.4 v55.88,46.29 | v55.39,12.23 55.39,12.02 54.36,10.99 52.45,10.99 v52.32,11.11
GPIO12  (via drill 0.6)
  Top 0.305: IOH.5 30.61,50.1 32.13,48.58 38.23,48.58 IOH.1
  Top 0.406: U3.GPIO12 49.27,33.85 v48.89,34.23
  Bottom 0.406: v48.89,34.23 49.78,35.12 49.78,45.15 48.77,46.16 48.77,47.69 48.39,48.07 45.21,48.07 44.45,48.83 42.42,51.12 IOH.1
GPIO13  (via drill 0.6)
  Top 0.305: IOH.4 33.15,49.97 33.91,49.21 36.32,49.21 IOH.2
  Top 0.406: U3.GPIO13 47.27,33.7 47.24,33.85 47.75,34.35 47.75,35.24 47.24,35.75 v46.99,36
  Bottom 0.406: v46.99,36 47.62,36.64 47.62,43.37 43.81,47.69 39.37,47.69 38.23,48.83 IOH.2
GPIO14  (via drill 0.6)
  Top 0.305: IOL.8 45.09,50.74 43.05,48.83 39.62,48.83 39.62,48.7 38.86,47.94 31.24,47.94 IOH.6
  Top 0.406: U3.GPIO14 51.27,34.06 v51.18,34.35
  Bottom 0.406: v51.18,34.35 51.31,47.82 49.91,48.96 46.74,49.09 IOL.8
GPIO15  (via drill 0.6)
  Top 0.305: U3.GPIO15 47.27,13.04 v46.35,12.13
  Bottom 0.305: v46.35,12.13 42.93,15.56 42.93,18.61 42.55,19.11 R14.2
  Bottom 0.406: IOH.3 35.69,49.85 40.64,44.39 40.89,44.13 40.89,41.21 40.39,40.83 40.39,38.04 38.35,36.51 38.35,30.29 37.21,29.02 37.21,28.51 38.73,26.99 38.86,21.02 40.26,19.62 R14.2
GPIO16  (via drill 0.6)
  Top 0.305: U3.GPIO16 53.27,35.17 v54.61,36.39
  Bottom 0.305: v54.61,36.39 54.61,47.94 IOL.3
M8RXD
  Top 0.406: U4.6 21.18,46.27 R9.1
M8TXD
  Top 0.406: R10.1 49.4,46.67 48.01,45.28 46.1,45.28 43.81,47.56 40.51,47.56 37.21,44.26 34.92,44.26 34.42,44.77 22.35,44.77 19.81,42.23 U4.5
N$1
  Bottom 0.61: LED3.A 27.3,15.56 R7.1
N$2
  Top 0.305: U2.5 9.27,25.08 9.02,25.34 9.02,34.48 10.41,35.88 13.72,35.88 14.1,36.26 14.1,47.94 13.46,48.58 LED4.K
N$3  (via drill 3.2 pad 2.54)
  other vias: 13.28,2.91
N$4
  Top 0.305: U4.4 22.23,39.69 23.49,40.96 R3.1
N$5
  Bottom 0.305: LED1.K 29.84,21.3 25.91,25.23 26.03,28.94 24.79,30.31 23.98,30.31 21.72,32.7 20.19,34.3 20.07,34.35 19.81,34.56 19.76,34.61 U4.2
N$6
  Bottom 0.305: LED2.K 29.79,25.72 29.62,25.9 29.62,26 28.14,27.47 28.14,27.75 28.19,31.25 27.69,31.76 25.63,31.79 25.12,32.27 25.02,33.74 22.61,36.03 21.39,37.1 19.74,37.1 U4.3
N$7
  Top 0.305: R4.2 25.65,22.29 LED1.A
N$8
  Top 0.305: R5.2 26.29,24.83 LED2.A
N$9  (1 unrouted)
  Top 0.305: X2.1 8.4,37.17 9.4,38.04 9.4,43.62 8.25,44.77 8.25,50.61 7.11,51.75 R11.1
  Top 0.61: 2.54,25.72 3.18,26.35 U2.3 7.94,26.35 7.94,27.62 | 7.94,27.62 U2.2 | 7.94,27.62 7.89,27.57
  Top 0.813: X2.1 7.89,27.57
N$10
  Top 0.305: U7.4 4.19,19.49 4.06,19.37 4.06,15.94 2.67,14.54 1.97,14.54 D1.C
  Bottom 0.406: R1.1 11.94,6.16 10.92,5.14 9.4,5.14 7.75,6.79 6.22,6.79 3.94,4.51 3.43,4.51 1.14,6.79 1.14,13.72 D1.C
N$11  (via drill 0.6)
  Top 0.305: U2.4 4.19,25.08 v3.68,24.57
  Bottom 0.305: R2.1 0.89,17.84 0.89,23.81 1.65,24.32 3.43,24.32 v3.68,24.57 4.32,23.94 12.32,23.94 12.57,23.69 12.57,21.53 14.1,20 LED5.A
N$12
  Top 0.406: R17.1 29.46,30.42 28.7,31.05 28.7,35.5 T1.2
N$13
  Bottom 0.305: LED4.A 6.98,49.21 8.25,50.48 9.91,50.48 R11.2
N$15
  Top 0.305: C12.2 10.1,45.12 10.1,42.23 10.11,41.66 10.16,41.59 U4.11
N$16  (via drill 3.2 pad 2.54)
  other vias: 65.38,7.94
N$17
  Top 0.305: U7.5 11.94,19.49 13.46,17.97 15.24,17.97 LED5.K
N$18  (via drill 3.2 pad 2.54)
  other vias: 65.38,35.88
N$19  (via drill 3.2)
  other vias: 14.61,51.12
N$21
  Bottom 0.406: R18.1 26.54,33.08 26.67,33.21 25.4,34.61 25.4,37.78 T2.2
PWRIN
  Top 0.61: POWER.8 45.09,1.59 43.81,0.63 26.35,0.63 26.03,0.95 18.41,0.95 17.27,1.59 D2.A 17.27,6.67 15.32,8.62 X1.2
RESET  (via drill 0.6)
  Top 0.406: 32.51,37.53 C7.1 34.16,39.18 R8.2 39.55,39.23 SW1.P$1 43.87,37.91 53.34,37.91 54.36,38.93 57.66,38.93 59.18,37.4 59.18,31.48 U3.RESET | 32.51,37.53 T1.3 | 32.51,37.53 v31.62,36.64 | v32,16.95 34.04,18.99 v34.16,18.99 37.59,18.99 40.51,21.91 D4.C | v29.72,6.16 29.72,6.03 32.38,3.37 POWER.3
  Bottom 0.406: v31.62,36.64 31.62,32.19 35.43,29.4 35.56,24.19 35.56,19.37 35.05,18.86 v34.16,18.99 | v32,16.95 32,8.57 v29.72,6.16
RTS  (via drill 0.6)
  Top 0.305: v30.1,15.94 30.1,18.48 28.58,20 28.58,21.78 28.96,22.16 30.48,22.16 v30.86,21.78 | R18.2 33.02,33.08 28.32,37.4 27.43,37.4 T1.1 27.18,37.4
  Top 0.406: U4.7 18.8,47.31 17.91,46.42 17.91,38.8 18.29,38.42 23.62,38.42 24.77,37.4 27.18,37.4
  Bottom 0.254: 28.58,1.59 28.58,14.41 v30.1,15.94 | 31.12,25.21 31.12,26.1 | 30.86,30.04 30.86,30.67 | 30.86,31.05 26.42,35.5 26.42,36.89 26.92,37.4 T1.1
  Bottom 0.305: 32.38,1.46 31.62,0.7 29.59,0.7 28.58,1.59 | v30.86,21.78 30.86,24.83 31.12,25.21 | 31.12,26.1 30.86,26.35 30.86,30.04
  Bottom 0.406: 30.86,30.67 30.86,31.05
RX  (via drill 0.6)
  Top 0.406: U3.RXD0 57.4,14.94 v57.4,12.64 | CN1.2 61.09,42.23 59.94,41.21 v57.28,41.21 56.9,41.34 48.39,41.34 46.48,43.24 v39.5,43.37 | R9.2 33.83,46.16 D3.C
  Bottom 0.406: IOL.1 62.99,50.99 62.99,46.42 CN1.2 | v57.4,12.64 57.28,12.76 57.15,33.72 57.78,34.35 57.78,35.5 57.28,36 v57.28,41.21 | v39.5,43.37 37.97,43.37 36.2,45.15 D3.C
TX  (via drill 0.6)  (1 unrouted)
  Top 0.406: U3.TXD0 59.69,14.65 59.69,13.4 60.2,12.89 v60.2,12.76
  Bottom 0.406: v60.2,12.76 58.42,14.54 58.42,33.34 59.06,33.97 59.06,35.88 58.55,36.39 CN1.3 60.33,46.55 IOL.2
USHIELD
  Top 0.305: X2.P$2 3.18,35.56 2.22,36.51 2.22,43.46 X2.P$1
  Bottom 0.61: L1.2 0.95,46.64 X2.P$1
VIN  (via drill 0.6)
  Top 0.61: v27.43,7.68 26.14,6.36 25.98,6.21 24.64,6.21 U1.3
  Bottom 0.61: v27.43,7.68 25.91,9.08 25.78,9.21 18.41,9.21 17.27,10.35 D2.C 17.27,13.65 C4.+ 15.24,15.94 R1.2

### Text on the board
Top: TOP
Bottom: BOT
tPlace: TX | RX | SCL | SDA | D8 | D7 | D6 | D5 | D4 | D3 | D2 | D1 | D0 | GND | SCK | MISO | MOSI | RESET | TX | RX | 3V3 | 3.3V | GND | GND | Vin | 3V3 | SCL | SDA | GND | SDA | SCL | IOREF | RST | 5V | A0 | REV. 3 / 02/2020 | POWER
tNames: + | OC | GND | WWW.SCHIRMILABS.DE | DESIGN BY HMS | EDUINO | + | RX | + | OC | TX | + | WIFI | + | ON
bNames: EDUINO | WIFI | DESIGN BY HMS / ----------------- / WWW.SCHIRMILABS.DE / -----------------